# Altium project HV_BMS.PrjPcb (part 2 of 2)

## Sheet isoSPI_Interface.SchDoc
size Letter; Organization: Midnight Sun Solar Rayce Car Team; Address1: University of Waterloo; Address2: 200 University Ave W; Address3: Waterloo, ON, Canada; Address4: N2L 3E9; Website: www.uwmidsun.com
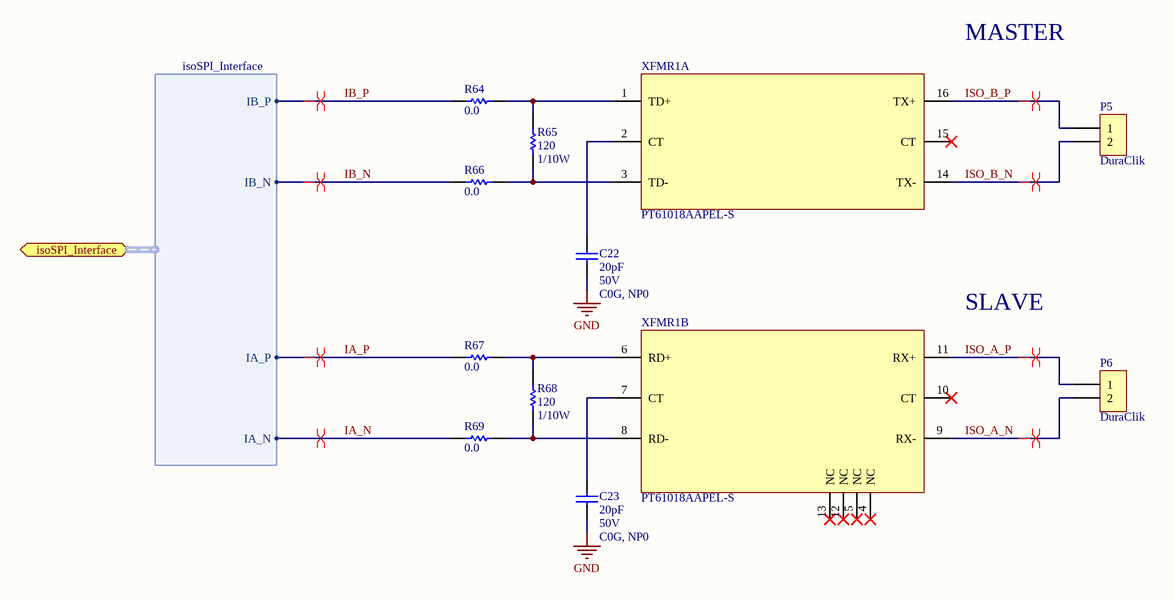
[diagram p3: isoSPI_Interface.SchDoc]

### Parts
C22  Capacitance: 20pF  Voltage: 50V  Temperature Coefficient: C0G, NP0  [CAP, 0603]  (hidden comment: CAP CER 20PF 50V ±5% C0G/NP0 0603)
C23  Capacitance: 20pF  Voltage: 50V  Temperature Coefficient: C0G, NP0  [CAP, 0603]  (hidden comment: CAP CER 20PF 50V ±5% C0G/NP0 0603)
P5  Series: DuraClik  [CONN, 2POS Dura-Click]  (hidden comment: CONN 2POS DURA-CLIK 0.079")
P6  Series: DuraClik  [CONN, 2POS Dura-Click]  (hidden comment: CONN 2POS DURA-CLIK 0.079")
R64  Resistance: 0.0  [RES, 0603]  (hidden comment: RES 0.0 OHM 1/4W 0603)
R65  Resistance: 120  Power: 1/10W  [RES, 0603]  (hidden comment: RES 120 OHM 1% 1/10W 0603)
R66  Resistance: 0.0  [RES, 0603]  (hidden comment: RES 0.0 OHM 1/4W 0603)
R67  Resistance: 0.0  [RES, 0603]  (hidden comment: RES 0.0 OHM 1/4W 0603)
R68  Resistance: 120  Power: 1/10W  [RES, 0603]  (hidden comment: RES 120 OHM 1% 1/10W 0603)
R69  Resistance: 0.0  [RES, 0603]  (hidden comment: RES 0.0 OHM 1/4W 0603)
XFMR1  MFG_PN: PT61018AAPEL-S  [IC, PULSE XFMR 1CT:1CT 350UH SMD]  (hidden comment: IC PULSE XFMR 1CT:1CT 350UH SMD)  (parts A,B of 2)

### Ports
isoSPI_Interface (harness isoSPI_Interface)

### Harnesses
isoSPI_Interface: IB_P, IB_N, IA_P, IA_N

### Nets
GND: C22.2 C23.2
IA_N: R69.1 ; port isoSPI_Interface.IA_N
IA_P: R67.1 ; port isoSPI_Interface.IA_P
IB_N: R66.1 ; port isoSPI_Interface.IB_N
IB_P: R64.1 ; port isoSPI_Interface.IB_P
ISO_A_N: P6.2 XFMR1.9(RX-)
ISO_A_P: P6.1 XFMR1.11(RX+)
ISO_B_N: P5.2 XFMR1.14(TX-)
ISO_B_P: P5.1 XFMR1.16(TX+)
NetC22_1: C22.1 XFMR1.2(CT)
NetC23_1: C23.1 XFMR1.7(CT)
NetR64_2: R64.2 R65.1 XFMR1.1(TD+)
NetR65_2: R65.2 R66.2 XFMR1.3(TD-)
NetR67_2: R67.2 R68.1 XFMR1.6(RD+)
NetR68_2: R68.2 R69.2 XFMR1.8(RD-)

Not connected (* = marked no-connect by the designer): XFMR1 4(NC)* 5(NC)* 10(CT)* 12(NC)* 13(NC)* 15(CT)*

### Layout directives
differential pair: IA_N, IA_P, IB_N, IB_P, ISO_A_N, ISO_A_P, ISO_B_N, ISO_B_P

### Notes on the sheet
- MASTER
- SLAVE
- Project:
- Title:
- Size:
- Project Lead:
- Letter
- Revision:
- University of Waterloo
- 200 University Ave W
- Waterloo, ON, Canada
- N2L 3E9
- Date:
- Sheet
- of
- Website:

### Library data of the parts
C22 C23 = CAP CER 20PF 50V ±5% C0G/NP0 0603: 20pF ±5% 50V Ceramic Capacitor C0G, NP0 0603 (1608 Metric); Manufacturer 1: Murata Electronics North America; Manufacturer Part Number 1: GRM1885C1H200JA01D; Supplier 1: Digi-Key; Supplier Part Number 1: 490-1410-1-ND; Packaging: Cut Tape (CT); Part Status: Active; Operating Temperature: -55°C ~ 125°C; Ratings: -; Mounting Type: Surface Mount, MLCC; Package / Case: 0603 (1608 Metric); Size / Dimension: 0.063" L x 0.031" W (1.60mm x 0.80mm); Height - Seated (Max): -; Thickness (Max): 0.035" (0.90mm); Lead Spacing: -; Lead Style: -; ComponentLink1URL: http://www.murata.com/~/media/webrenewal/support/library/catalog/products/capacitor/mlcc/c02e.ashx; ComponentLink1Description: http://www.murata.com/~/media/webrenewal/support/library/catalog/products/capacitor/mlcc/c02e.ashx; Tolerance: ±5%
P5 P6 = CONN 2POS DURA-CLIK 0.079": 2 Positions Header, Shrouded Connector 0.079" (2.00mm) Surface Mount, Right Angle Tin; Manufacturer 1: Molex, LLC; Manufacturer Part Number 1: 5023520200; Style: Board to Cable/Wire; Shrouding: Shrouded - 4 Wall; Number of Positions: 2; Number of Positions Loaded: All; Contact Length - Mating: 0.135" (3.45mm); Material Flammability Rating: UL94 V-0; Mated Stacking Heights: 11mm; Supplier 1: Digi-Key; Supplier Part Number 1: WM7169CT-ND; Packaging: Cut Tape (CT); Part Status: Active; Connector Type: Header; Contact Type: Male Pin; Number of Rows: 1; Row Spacing - Mating: -; Mounting Type: Surface Mount, Right Angle; Termination: Solder; Fastening Type: Latch Lock; Contact Length - Post: -; Overall Contact Length: -; Insulation Height: 0.252" (6.40mm); Contact Shape: Square; Contact Finish - Mating: Tin; Contact Finish Thickness - Mating: -; Contact Finish - Post: Tin; Contact Material: Copper Alloy; Insulation Material: Polyamide (PA), Nylon; Operating Temperature: -; Ingress Protection: -; Insulation Color: Natural; Current Rating: -; Contact Finish Thickness - Post: -; ComponentLink1URL: http://www.molex.com/pdm_docs/sd/5023520200_sd.pdf; ComponentLink1Description: http://www.molex.com/pdm_docs/sd/5023520200_sd.pdf; Voltage: -; Pitch - Mating: 0.079" (2.00mm)
R64 R66 R67 R69 = RES 0.0 OHM 1/4W 0603: RES SMD 0.0 OHM JUMPER 1/4W 0603; Manufacturer 1: Vishay Dale; Manufacturer Part Number 1: CRCW06030000Z0EAHP; Supplier 1: Digi-Key; Supplier Part Number 1: 541-0.0SBCT-ND; Packaging: Cut Tape (CT); Part Status: Active; Composition: Thick Film; Operating Temperature: -55°C ~ 155°C; Package / Case: 0603 (1608 Metric); Supplier Device Package: 0603; Size / Dimension: 0.063" L x 0.033" W (1.60mm x 0.85mm); Height - Seated (Max): 0.022" (0.55mm); Failure Rate: -; ComponentLink1URL: http://www.vishay.com/docs/20043/crcwhpe3.pdf; ComponentLink1Description: http://www.vishay.com/docs/20043/crcwhpe3.pdf; Power (Watts): 1/4W
R65 R68 = RES 120 OHM 1% 1/10W 0603: RES SMD 120 OHM 1% 1/10W 0603; Manufacturer 1: Yageo; Manufacturer Part Number 1: RC0603FR-07120RL; Temperature Coefficient: ±100ppm/°C; Supplier 1: Digi-Key; Supplier Part Number 1: 311-120HRCT-ND; Packaging: Cut Tape (CT); Part Status: Active; Composition: Thick Film; Operating Temperature: -55°C ~ 155°C; Package / Case: 0603 (1608 Metric); Supplier Device Package: 0603; Size / Dimension: 0.063" L x 0.031" W (1.60mm x 0.80mm); Height - Seated (Max): 0.022" (0.55mm); Failure Rate: -; ComponentLink1URL: http://www.yageo.com/documents/recent/PYu-RC_Group_51_RoHS_L_7.pdf; ComponentLink1Description: http://www.yageo.com/documents/recent/PYu-RC_Group_51_RoHS_L_7.pdf; Tolerance: ±1%
XFMR1 = IC PULSE XFMR 1CT:1CT 350UH SMD: PULSE XFMR 1CT:1CT 350UH SMD; Manufacturer: Bourns Inc.; Isolation Voltage: 1.5kVrms; Supplier: Digikey; Supplier_PN: PT61018AAPEL-SCT-ND; Inductance: 350uH; Supplier 1: Digi-Key; Supplier Part Number 1: PT61018AAPEL-SCT-ND

## Nets that join several sheets
+5V: AFE (6 pins), Thermistor_Interface (C20.1 U3.24 U4.5)
GND: AFE (19 pins), Thermistor_Interface (21 pins), isoSPI_Interface (C22.2 C23.2)
AUX_ADC_IN_b: AFE (U2.27), Thermistor_Interface (C21.1 R47.2)
C0: AFE (R22.1), Cell+Balancing_Interface (P2.7 R46.2)
C1: AFE (R20.1), Cell+Balancing_Interface (P2.6 Q12.2 R42.2)
C2: AFE (R19.1), Cell+Balancing_Interface (P2.5 Q10.2 R38.2)
C3: AFE (R18.1), Cell+Balancing_Interface (P2.4 Q8.2 R34.2)
C4: AFE (R17.1), Cell+Balancing_Interface (P2.3 Q6.2 R30.2)
C5: AFE (R16.1), Cell+Balancing_Interface (P2.2 Q4.2 R26.2)
C6: AFE (R15.1), Cell+Balancing_Interface (P1.7 P2.1 Q2.2 R45.2)
C7: AFE (R14.1), Cell+Balancing_Interface (P1.6 Q11.2 R41.2)
C8: AFE (R12.1), Cell+Balancing_Interface (P1.5 Q9.2 R37.2)
C9: AFE (R11.1), Cell+Balancing_Interface (P1.4 Q7.2 R33.2)
C10: AFE (R8.1), Cell+Balancing_Interface (P1.3 Q5.2 R29.2)
C11: AFE (R7.1), Cell+Balancing_Interface (P1.2 Q3.2 R25.2)
C12: AFE (R2.2 R6.1), Cell+Balancing_Interface (P1.1 Q1.2)
IA_N: AFE (R72.1), isoSPI_Interface (R69.1)
IA_P: AFE (R71.1), isoSPI_Interface (R67.1)
IB_N: AFE (U2.47), isoSPI_Interface (R66.1)
IB_P: AFE (U2.48), isoSPI_Interface (R64.1)
S1: AFE (U2.25), Cell+Balancing_Interface (R44.1)
S2: AFE (U2.23), Cell+Balancing_Interface (R40.1)
S3: AFE (U2.21), Cell+Balancing_Interface (R36.1)
S4: AFE (U2.19), Cell+Balancing_Interface (R32.1)
S5: AFE (U2.17), Cell+Balancing_Interface (R28.1)
S6: AFE (U2.15), Cell+Balancing_Interface (R24.1)
S7: AFE (U2.13), Cell+Balancing_Interface (R43.1)
S8: AFE (U2.11), Cell+Balancing_Interface (R39.1)
S9: AFE (U2.9), Cell+Balancing_Interface (R35.1)
S10: AFE (U2.7), Cell+Balancing_Interface (R31.1)
S11: AFE (U2.5), Cell+Balancing_Interface (R27.1)
S12: AFE (U2.3), Cell+Balancing_Interface (R23.1)
T_SEL0: AFE (U2.28), Thermistor_Interface (U3.10)
T_SEL1: AFE (U2.29), Thermistor_Interface (U3.11)
T_SEL2: AFE (U2.32), Thermistor_Interface (U3.14)
T_SEL3: AFE (U2.33), Thermistor_Interface (U3.13)